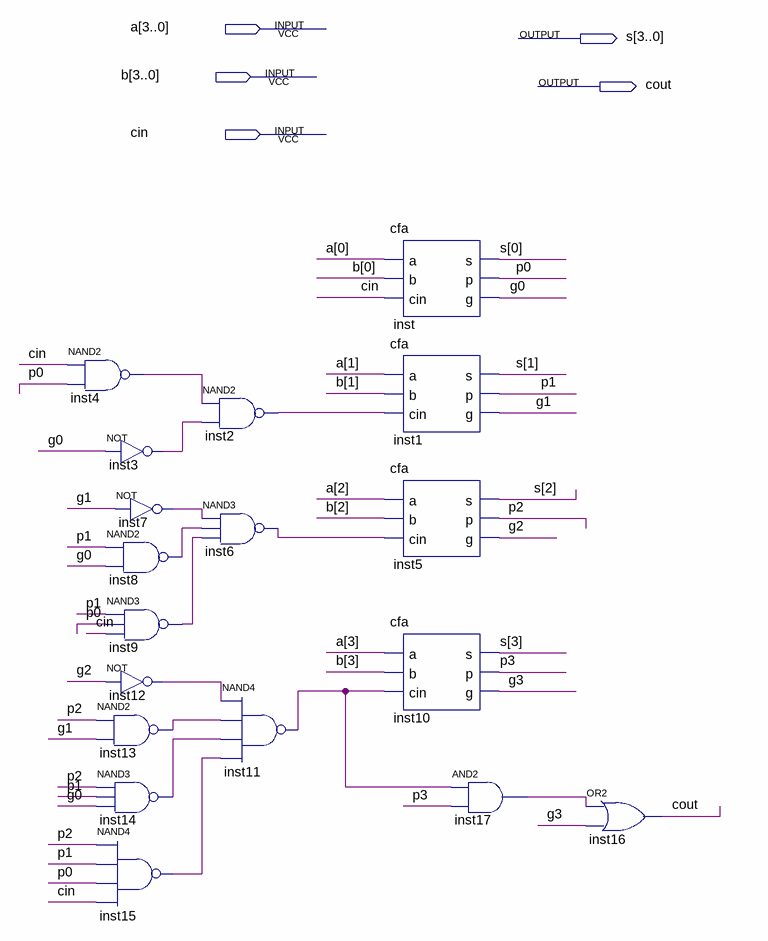
[diagram p0: schematic sheet]
// Quartus schematic cla.bdf as structural Verilog: 18 symbols, 5 pins
module cla (
  input  [3:0] a,
  input  [3:0] b,
  input  cin,
  output [3:0] s,
  output cout
);

  wire g0, g1, g2, g3, inst2_out, inst3_out, inst4_out, inst6_out, inst7_out, inst8_out, inst9_out,
       inst11_out, inst12_out, inst13_out, inst14_out, inst15_out, inst17_out, p0, p1, p2, p3;

  nand inst4 (inst4_out, cin, p0);
  not inst3 (inst3_out, g0);
  not inst7 (inst7_out, g1);
  nand inst8 (inst8_out, p1, g0);
  nand inst9 (inst9_out, p1, p0, cin);
  not inst12 (inst12_out, g2);
  nand inst13 (inst13_out, p2, g1);
  nand inst14 (inst14_out, p2, p1, g0);
  nand inst15 (inst15_out, p2, p1, p0, cin);
  nand inst2 (inst2_out, inst4_out, inst3_out);
  nand inst6 (inst6_out, inst7_out, inst8_out, inst9_out);
  nand inst11 (inst11_out, inst12_out, inst13_out, inst14_out, inst15_out);
  cfa inst (.a(a[0]), .b(b[0]), .cin(cin), .s(s[0]), .p(p0), .g(g0));
  cfa inst1 (.a(a[1]), .b(b[1]), .cin(inst2_out), .s(s[1]), .p(p1), .g(g1));
  cfa inst5 (.a(a[2]), .b(b[2]), .cin(inst6_out), .s(s[2]), .p(p2), .g(g2));
  cfa inst10 (.a(a[3]), .b(b[3]), .cin(inst11_out), .s(s[3]), .p(p3), .g(g3));
  and inst17 (inst17_out, inst11_out, p3);
  or inst16 (cout, inst17_out, g3);
endmodule
